# EAGLE design servo_extern (EAGLE 4.16)
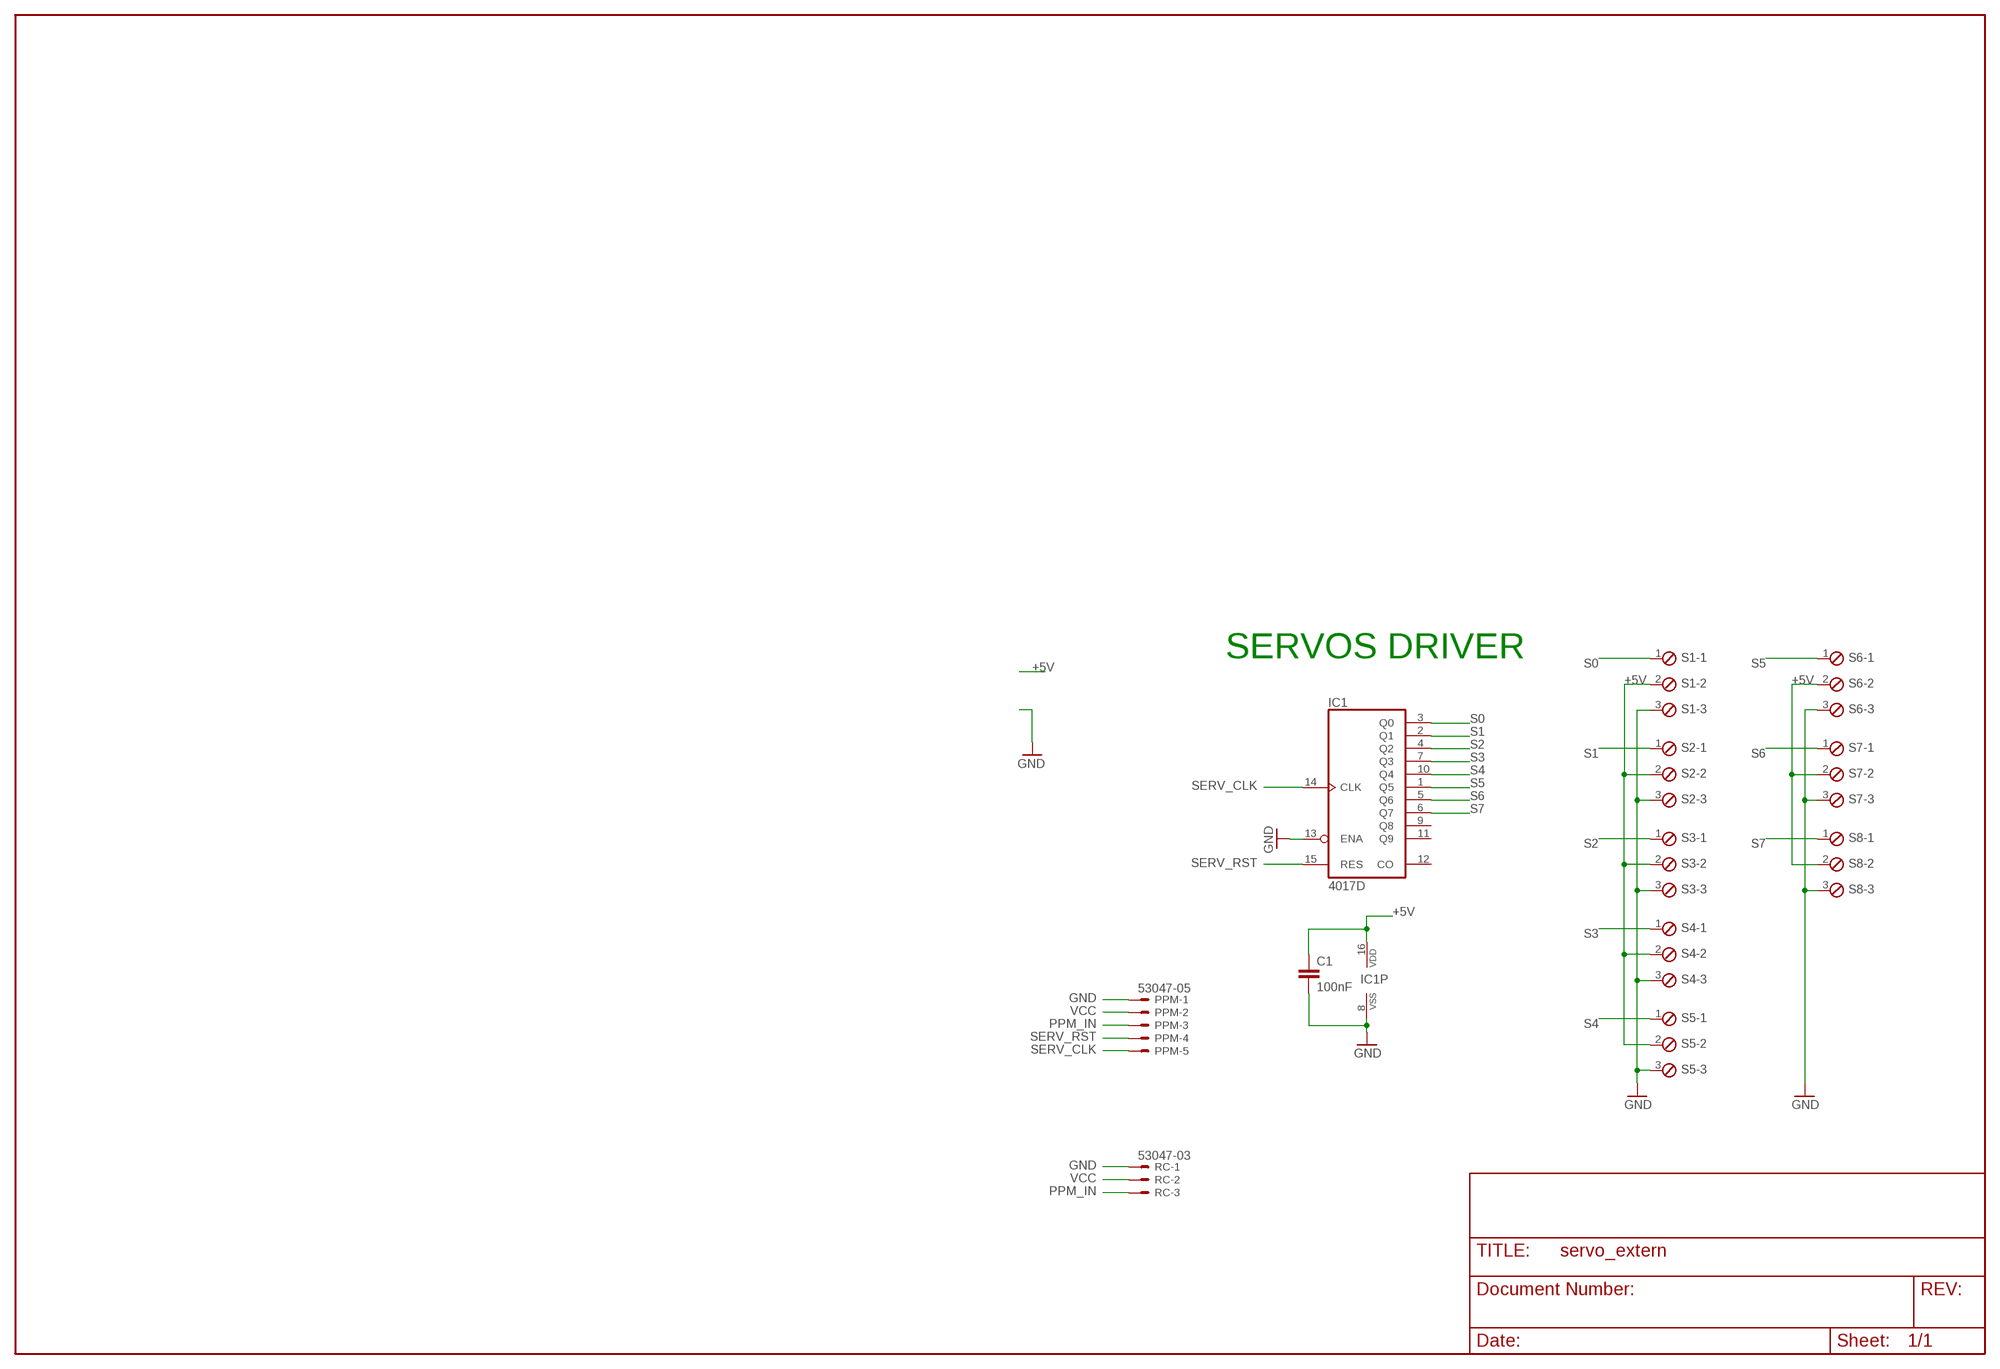
[diagram p0: schematic, sheet 1]

## Parts
C1  100nF  C-EUC0603  [C0603]
IC1  4017D  [SO16]
PPM  53047-05  [53047-05]
RC  53047-03  [53047-03]
S1  MPT3  [3POL254]
S2  MPT3  [3POL254]
S3  MPT3  [3POL254]
S4  MPT3  [3POL254]
S5  MPT3  [3POL254]
S6  MPT3  [3POL254]
S7  MPT3  [3POL254]
S8  MPT3  [3POL254]

## Nets
+5V: C1.1 IC1.16(VDD) S1.2 S2.2 S3.2 S4.2 S5.2 S6.2 S7.2 S8.2
GND: C1.2 IC1.8(VSS) IC1.13(ENA) PPM.1 RC.1 S1.3 S2.3 S3.3 S4.3 S5.3 S6.3 S7.3 S8.3
PPM_IN: PPM.3 RC.3
S0: IC1.3(Q0) S1.1
S1: IC1.2(Q1) S2.1
S2: IC1.4(Q2) S3.1
S3: IC1.7(Q3) S4.1
S4: IC1.10(Q4) S5.1
S5: IC1.1(Q5) S6.1
S6: IC1.5(Q6) S7.1
S7: IC1.6(Q7) S8.1
SERV_CLK: IC1.14(CLK) PPM.5
SERV_RST: IC1.15(RES) PPM.4
VCC: PPM.2 RC.2
Unconnected: IC1.9(Q8) IC1.11(Q9) IC1.12(CO)

## Notes on the sheet
- SERVOS DRIVER

## Library data of the parts
C1 = rcl:C-EU: CAPACITOR, European symbol
IC1 = 40xx:4017: COUNTER/DIVIDER
PPM = con-molex:53?-05: CONNECTOR wire to board 1.25 mm (.049 inch) pitch header
RC = con-molex:53?-03: CONNECTOR wire to board 1.25 mm (.049 inch) pitch header
S1-S8 = paparazzi:MPT3: PHOENIX CONNECTOR

## Board
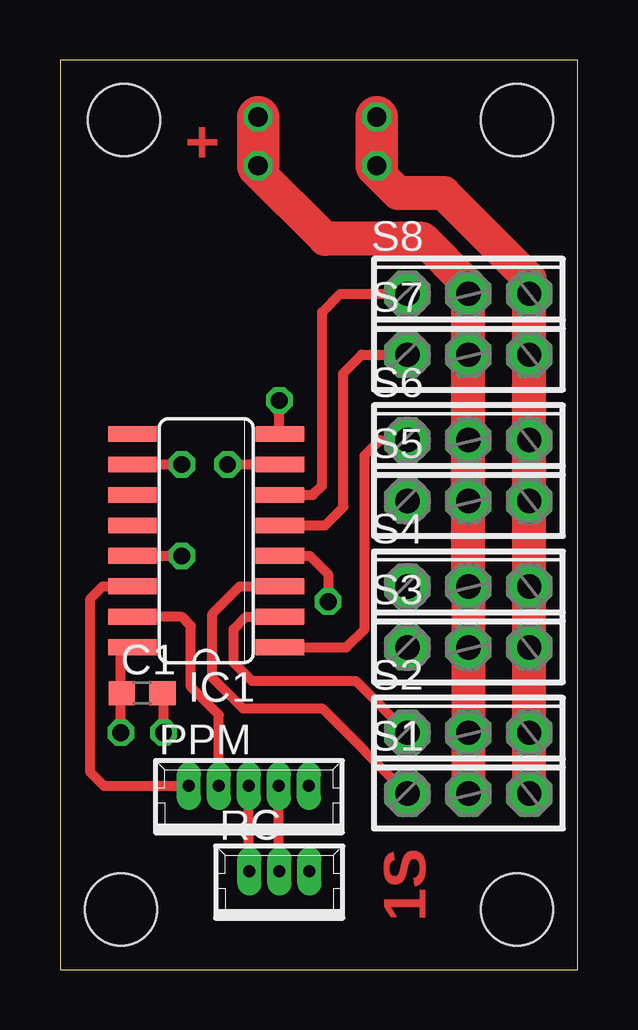
[diagram p1: board, top side]
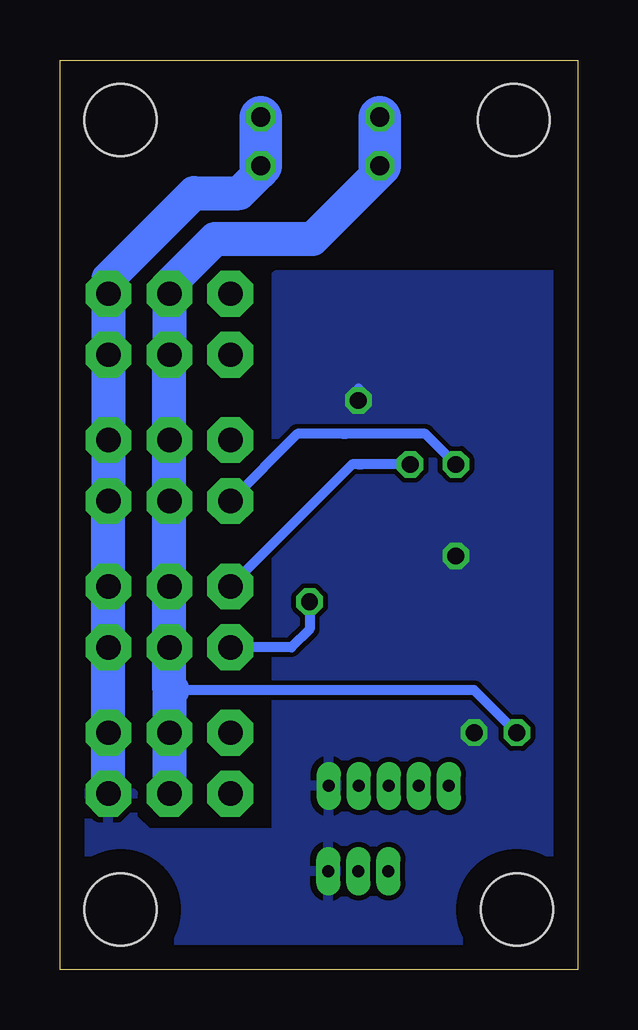
[diagram p2: board, bottom side, seen from below]

Size 21.57 x 37.9 mm. Coordinates in mm from the lower left corner, seen from the top.
Outline: 0,0 21.57,0 21.57,37.9 0,37.9 0,0
Copper layers (1*16): Top 0.035mm / dielectric 1.5mm / Bottom 0.035mm
Design rules "default": minimum track width 10mil, minimum drill 12mil, track to track 8mil, track to pad 8mil, pad to pad 8mil, via to via 8mil, smd to smd 8mil, copper to edge 40mil, drill to drill 8mil, minimum pad ring 10mil, minimum via ring 8mil, stop-mask expansion 4mil, vias tented up to drill 0mil, thermal gap 10mil
Holes 3 mm at 19.05,35.4 19.05,2.5 2.54,2.5 2.66,35.4

### Footprints (pad centres in the part's own frame; a part is rotated, then mirrored left to right if it is on the bottom)
C0603 = smd 1.1 x 1: 1 -0.85,0; 2 0.85,0
SO16 = smd 0.66 x 2.032: 1 -4.445,-3.073; 2 -3.175,-3.073; 3 -1.905,-3.073; 4 -0.635,-3.073; 5 0.635,-3.073; 6 1.905,-3.073; 7 3.175,-3.073; 8 4.445,-3.073; 9 4.445,3.073; 10 3.175,3.073; 11 1.905,3.073; 12 0.635,3.073; 13 -0.635,3.073; 14 -1.905,3.073; 15 -3.175,3.073; 16 -4.445,3.073
53047-05 = drill 0.5 pad 0.698 long: 1 2.5,0.45; 2 1.25,0.45; 3 0,0.45; 4 -1.25,0.45; 5 -2.5,0.45
53047-03 = drill 0.5 pad 0.698 long: 1 1.25,0.45; 2 0,0.45; 3 -1.25,0.45
3POL254 = drill 1.016 pad 1.905 octagon: 1 -2.54,0; 2 0,0; 3 2.54,0

### Placement (x,y rotation side)
C1  3.42,11.52 0 top
IC1  6.09,17.87 90 top
PPM  7.87,7.2 0 top
RC  9.14,3.65 0 top
S1  17.01,7.33 0 top
S2  17.01,9.87 0 top
S3  17.01,13.42 0 top
S4  17.01,15.96 0 top
S5  17.01,19.52 0 top
S6  17.01,22.06 0 top
S7  17.01,25.62 0 top
S8  17.01,28.16 0 top

### Tracks (layer width: path | path; a pad name or v marks a point on that pad's centre or on a via)
+5V  (via drill 0.7, 0.8)
  Top 0.406: IC1.16 2.66,13.42 2.54,13.3 2.54,11.52 C1.1 2.54,11.48 v2.54,9.87
  Top 1.422: v8.25,33.49 8.12,33.36 11.04,30.44 15.11,30.44 17.01,28.54 S8.2 S5.2 | S1.2 S4.2 17.01,19.39
  Top 1.778: v8.25,33.49 v8.25,35.52
  Bottom 0.406: v2.54,9.87 4.31,11.65 16.89,11.65
  Bottom 1.422: S6.2 17.01,21.93 | S6.2 S7.2 S8.2 17.01,28.54 15.11,30.44 11.04,30.44 8.12,33.36 | S5.2 17.01,19.39 | S5.2 S6.2 | S5.2 S4.2 S3.2 17.01,11.65 | 17.01,11.65 S2.2 S1.2 17.01,7.2 | 16.89,11.65 17.01,11.65 | v8.25,35.52 8.25,35.65
  Bottom 1.778: v8.25,33.49 v8.25,35.52
GND  (via drill 0.7, 0.8)
  Top 0.406: IC1.8 9.14,22.31 v9.14,23.71 | IC1.13 v5.08,17.23 | C1.2 4.31,11.48 v4.31,9.87
  Top 1.422: v13.2,33.49 13.2,33.24 14.09,32.35 16,32.35 19.55,28.79 S8.3 S1.3
  Top 1.778: v13.2,33.49 v13.2,35.52
  Bottom 0.406: v9.14,23.71 9.14,24.22 | v5.08,17.23 5.33,17.23 | v4.31,9.87 4.31,9.74
  Bottom 1.422: S5.3 19.55,19.39 | S5.3 S6.3 S7.3 S8.3 19.55,28.79 16,32.35 14.09,32.35 13.2,33.24 v13.2,33.49 | S5.3 S4.3 S3.3 S2.3 | S2.3 19.55,9.74 | 19.55,7.2 S1.3 S2.3
  Bottom 1.778: v13.2,33.49 v13.2,35.52 13.2,34.63
  pour Bottom: 0.38,28.92 12.57,28.92 12.57,5.68 17.9,5.68 18.54,6.31 18.54,7.33 20.7,7.33 20.7,0.47 0.38,0.47
PPM_IN
  Top 0.406: RC.3 7.89,4.05 7.87,4.03 PPM.3
S0
  Top 0.406: IC1.3 7.49,15.96 6.34,14.82 6.34,12.15 7.62,10.88 10.92,10.88 S1.1
S1
  Top 0.406: IC1.2 7.74,14.69 7.23,14.19 7.23,12.79 8,12.03 12.31,12.03 S2.1
S2  (via drill 0.7)
  Top 0.406: IC1.4 10.41,17.23 11.17,16.47 v11.17,15.33
  Bottom 0.406: v11.17,15.33 11.17,14.19 11.93,13.42 S3.1
S3  (via drill 0.7)
  Top 0.406: 9.27,21.04 IC1.7 v6.98,21.04
  Bottom 0.406: v6.98,21.04 9.01,21.04 | 9.01,21.04 9.14,21.04 | S4.1 9.39,21.04 9.01,21.04
S4  (via drill 0.7)
  Top 0.406: IC1.10 v5.08,21.04
  Bottom 0.406: 9.65,22.31 6.34,22.31 v5.08,21.04 | 9.65,22.31 9.77,22.31 | S5.1 11.68,22.31 9.65,22.31
S5
  Top 0.406: S6.1 13.33,22.06 12.69,21.43 12.69,14.19 11.93,13.42 9.14,13.42 | IC1.1 9.14,13.42 | 9.14,13.42 9.01,13.3
S6
  Top 0.406: IC1.5 11.04,18.5 11.81,19.27 11.81,24.85 12.57,25.62 S7.1
S7
  Top 0.406: IC1.6 10.54,19.77 10.92,20.16 10.92,27.39 11.68,28.16 S8.1
SERV_CLK
  Top 0.406: PPM.5 1.83,7.65 1.27,8.22 1.27,15.46 1.77,15.96 IC1.14
SERV_RST
  Top 0.406: 3.04,14.69 3.17,14.69 | PPM.4 6.62,10.61 5.46,11.77 5.46,14.31 5.08,14.69 3.04,14.69 | 3.04,14.69 IC1.15
VCC
  Top 0.406: RC.2 9.14,4.03 9.12,4.05 PPM.2

### Text on the board
Top: + | 1S